# Altium schematic sheet Drivers.SchDoc
size A4
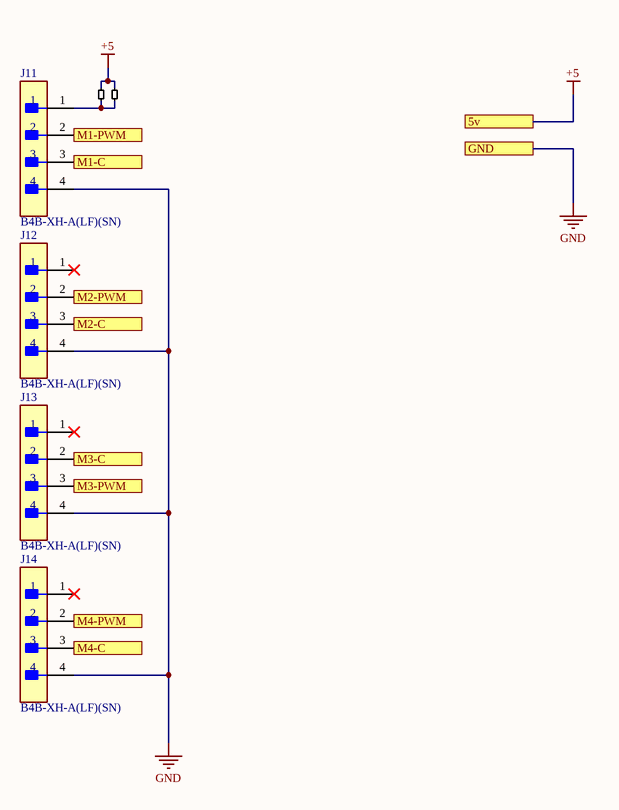
[diagram p0: Drivers.SchDoc]

## Parts
J11  B4B-XH-A(LF)(SN)  [FP-B4B-XH-A_LF_SN-MFG]
J12  B4B-XH-A(LF)(SN)  [FP-B4B-XH-A_LF_SN-MFG]
J13  B4B-XH-A(LF)(SN)  [FP-B4B-XH-A_LF_SN-MFG]
J14  B4B-XH-A(LF)(SN)  [FP-B4B-XH-A_LF_SN-MFG]
W30  Jumper  [Jumper Mid]  (value not drawn)
W31  Jumper  [Jumper Mid]  (value not drawn)

## Ports
5v, GND, M1-C, M1-PWM, M2-C, M2-PWM, M3-C, M3-PWM, M4-C, M4-PWM

## Nets
+5: W30.2 W31.2 ; port 5v
GND: J11.4 J12.4 J13.4 J14.4 ; port GND
M1-C: J11.3 ; port M1-C
M1-PWM: J11.2 ; port M1-PWM
M2-C: J12.3 ; port M2-C
M2-PWM: J12.2 ; port M2-PWM
M3-C: J13.2 ; port M3-C
M3-PWM: J13.3 ; port M3-PWM
M4-C: J14.3 ; port M4-C
M4-PWM: J14.2 ; port M4-PWM
NetJ11_1: J11.1 W30.1 W31.1

Not connected (* = marked no-connect by the designer): J12 1*; J13 1*; J14 1*

## Library data of the parts
J11-J14 = CMP-17439-000250-1: CONN HEADER VERT 4POS 2.5MM; Number of Contacts: 4; Contact Resistance: 20mR; Voltage Rating: 250V; Max Current Rating: 3A; Gender: Male; Wire/Cable Gauge: 22AWG; Mated Stacking Heights: 9.8mm; Insulation Resistance: 1GR; Orientation: Straight; Contact Type: Male Pin; Contact Finish - Mating: TIN; Series: XH; Max Voltage Rating (AC): 250V; Lead Pitch: 2.5mm; Contact Shape: Square; Insulation Color: Natural; Termination: Solder; Lead Free: Lead Free; Voltage Rating (AC): 250V; Number of Rows: 1; Flammability Rating: UL94 V-0; Number of Positions: 4; Max Operating Temperature: 85°C; Package Quantity: 500; Mount: Through Hole; REACH SVHC: No SVHC; Connector Type: Header; Insulation Material: Nylon; Fastening Type: Detent; Min Operating Temperature: -25°C; Housing Color: White; Packaging: Bulk; Contact Plating: Tin; Contact Material: Brass; Max Voltage Rating (DC): 250V; Housing Material: Polyamide; Color: Natural; Material: Polyamide; Pitch: 2.5mm; Depth: 5.75mm; Current Rating: 3A; Length: 12.4mm